# Altium schematic sheet Схема_узел_подключения светодиодной ленты.SchDoc
size A4
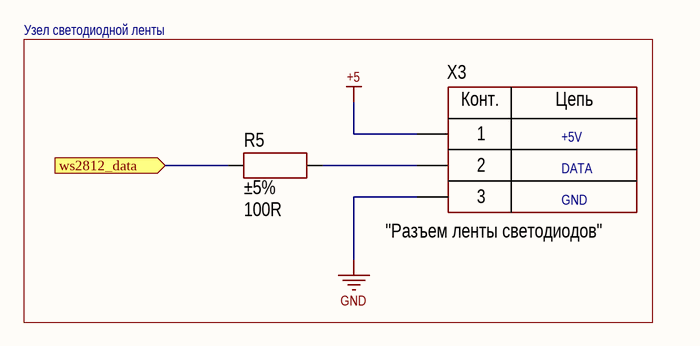
[diagram p0: Схема_узел_подключения светодиодной ленты.SchDoc]

## Parts
R5  value 100R  Tolerance: ±5%  [RES: 0603]
X3  CommentText: "Разъем ленты светодиодов"  [CON: DG350-3.5-03P]

## Ports
ws2812_data (in)

## Nets
+5: X3.1
GND: X3.3
ws2812_data: R5.1 ; port ws2812_data
NetR5_2: R5.2 X3.2

## Notes on the sheet
- Узел светодиодной ленты
- GND
- DATA
- +5V
- (in symbol Connector_terminal_3pin) Конт.; Цепь

## Library data of the parts
R5 = Resistor_0603: Manufacturer: Yageo; PartNumber: RC0603JR-07100RL; ValueManufacturerPartNumber: Resistor film, 100R, ±5%, 0603, 0.1W, -55...+125°C; TypeResistor: Resistor film; Power: 0.1W; Package: 0603; HelpURL: https://www.digikey.com/product-detail/en/yageo/RC0603JR-07100RL/311-100GRCT-ND/729644; Temperature: -55...+125°C
X3 = Connector_terminal_3pin: Manufacturer: Degson; ValueManufacturerPartNumber: Terminal connector, 3pin, 3.5mm, 300VAC, 10A; PartNumber: DG350-3.5-03P-14; TypeConnector: Terminal connector; VoltageMax: 300VAC; Pitch: 3.5mm; CurrentMax: 10A; Multichannel: 3pin; HelpURL: https://www.chipdip.ru/product/dg350-3.5-03p-12